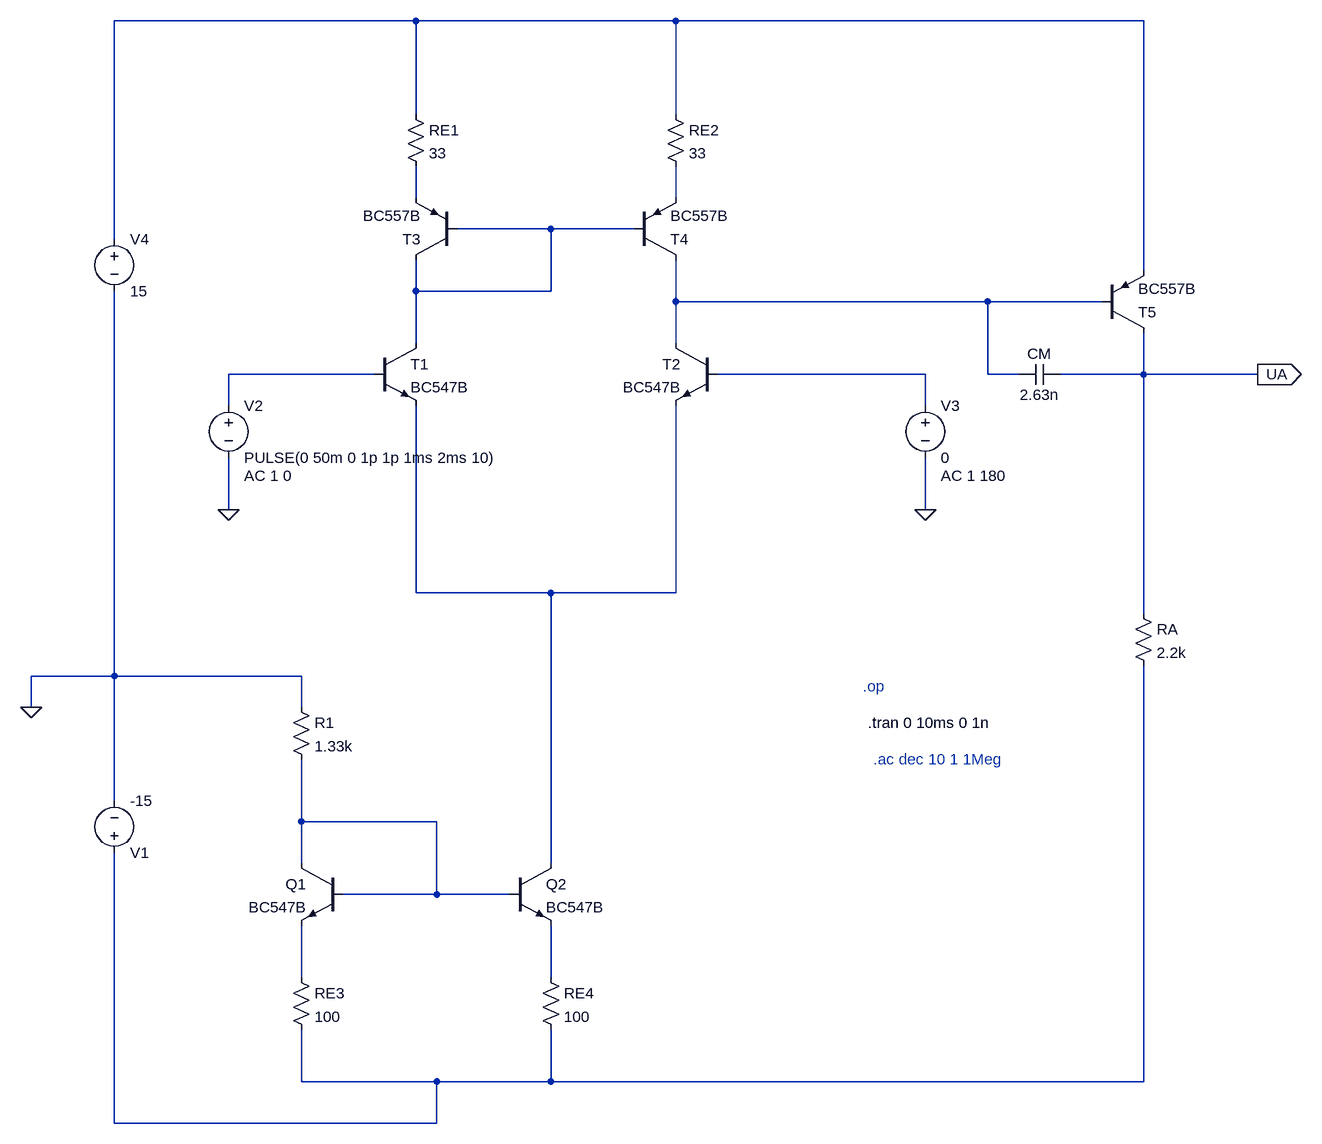
[diagram p0: schematic MillerOP.asc]
MillerOP.asc, the LTspice schematic file:
Version 4
SHEET 1 2404 2084
WIRE 992 256 528 256
WIRE 1392 256 992 256
WIRE 2112 256 1392 256
WIRE 992 400 992 256
WIRE 1392 400 1392 256
WIRE 992 528 992 480
WIRE 1392 528 1392 480
WIRE 1200 576 1056 576
WIRE 1328 576 1200 576
WIRE 528 592 528 256
WIRE 2112 640 2112 256
WIRE 992 672 992 624
WIRE 1200 672 1200 576
WIRE 1200 672 992 672
WIRE 1392 688 1392 624
WIRE 1872 688 1392 688
WIRE 2048 688 1872 688
WIRE 992 752 992 672
WIRE 1392 752 1392 688
WIRE 928 800 704 800
WIRE 1776 800 1456 800
WIRE 1872 800 1872 688
WIRE 1920 800 1872 800
WIRE 2112 800 2112 736
WIRE 2112 800 1984 800
WIRE 2288 800 2112 800
WIRE 704 848 704 800
WIRE 1776 848 1776 800
WIRE 704 1008 704 928
WIRE 1776 1008 1776 928
WIRE 992 1136 992 848
WIRE 1200 1136 992 1136
WIRE 1392 1136 1392 848
WIRE 1392 1136 1200 1136
WIRE 2112 1168 2112 800
WIRE 528 1264 528 672
WIRE 528 1264 400 1264
WIRE 816 1264 528 1264
WIRE 400 1312 400 1264
WIRE 816 1312 816 1264
WIRE 528 1456 528 1264
WIRE 816 1488 816 1392
WIRE 1024 1488 816 1488
WIRE 816 1552 816 1488
WIRE 1200 1552 1200 1136
WIRE 1024 1600 1024 1488
WIRE 1024 1600 880 1600
WIRE 1136 1600 1024 1600
WIRE 816 1728 816 1648
WIRE 1200 1728 1200 1648
WIRE 816 1888 816 1808
WIRE 1024 1888 816 1888
WIRE 1200 1888 1200 1808
WIRE 1200 1888 1024 1888
WIRE 2112 1888 2112 1248
WIRE 2112 1888 1200 1888
WIRE 528 1952 528 1536
WIRE 1024 1952 1024 1888
WIRE 1024 1952 528 1952
FLAG 704 1008 0
FLAG 1776 1008 0
FLAG 400 1312 0
FLAG 2288 800 UA
IOPIN 2288 800 Out
SYMBOL voltage 528 1552 M180
WINDOW 123 0 0 Left 0
WINDOW 39 0 0 Left 0
SYMATTR InstName V1
SYMATTR Value -15
SYMBOL res 800 1296 R0
SYMATTR InstName R1
SYMATTR Value 1.33k
SYMBOL npn 880 1552 M0
SYMATTR InstName Q1
SYMATTR Value BC547B
SYMBOL npn 1136 1552 R0
SYMATTR InstName Q2
SYMATTR Value BC547B
SYMBOL res 800 1712 R0
SYMATTR InstName RE3
SYMATTR Value 100
SYMBOL res 1184 1712 R0
SYMATTR InstName RE4
SYMATTR Value 100
SYMBOL npn 1456 752 M0
SYMATTR InstName T2
SYMATTR Value BC547B
SYMBOL npn 928 752 R0
SYMATTR InstName T1
SYMATTR Value BC547B
SYMBOL voltage 704 832 R0
WINDOW 123 24 124 Left 2
WINDOW 39 0 0 Left 0
SYMATTR InstName V2
SYMATTR Value PULSE(0 50m 0 1p 1p 1ms 2ms 10)
SYMATTR Value2 AC 1 0
SYMBOL voltage 1776 832 R0
WINDOW 123 24 124 Left 2
WINDOW 39 0 0 Left 0
SYMATTR InstName V3
SYMATTR Value 0
SYMATTR Value2 AC 1 180
SYMBOL voltage 528 576 R0
SYMATTR InstName V4
SYMATTR Value 15
SYMBOL pnp 1056 624 R180
SYMATTR InstName T3
SYMATTR Value BC557B
SYMBOL pnp 1328 624 M180
SYMATTR InstName T4
SYMATTR Value BC557B
SYMBOL res 976 384 R0
SYMATTR InstName RE1
SYMATTR Value 33
SYMBOL res 1376 384 R0
SYMATTR InstName RE2
SYMATTR Value 33
SYMBOL pnp 2048 736 M180
SYMATTR InstName T5
SYMATTR Value BC557B
SYMBOL res 2096 1152 R0
SYMATTR InstName RA
SYMATTR Value 2.2k
SYMBOL cap 1984 784 R90
WINDOW 0 0 32 VBottom 2
WINDOW 3 32 32 VTop 2
SYMATTR InstName CM
SYMATTR Value 2.63n
TEXT 1680 1280 Left 2 ;.op
TEXT 1688 1336 Left 2 !.tran 0 10ms 0 1n
TEXT 1696 1392 Left 2 ;.ac dec 10 1 1Meg

The netlist it stands for:
* MillerOP.asc
V1 N012 0 -15
R1 0 N009 1.33k
Q1 N009 N009 N010 0 BC547B
Q2 N008 N009 N011 0 BC547B
RE3 N010 N012 100
RE4 N011 N012 100
Q§T2 N005 N007 N008 0 BC547B
Q§T1 N004 N006 N008 0 BC547B
V2 N006 0 PULSE(0 50m 0 1p 1p 1ms 2ms 10) AC 1 0
V3 N007 0 0 AC 1 180
V4 N001 0 15
Q§T3 N004 N004 N002 0 BC557B
Q§T4 N005 N004 N003 0 BC557B
RE1 N001 N002 33
RE2 N001 N003 33
Q§T5 UA N005 N001 0 BC557B
RA UA N012 2.2k
CM UA N005 2.63n
.model NPN NPN
.model PNP PNP
.lib standard.bjt
* .op
.tran 0 10ms 0 1n
* .ac dec 10 1 1Meg
.backanno
.end